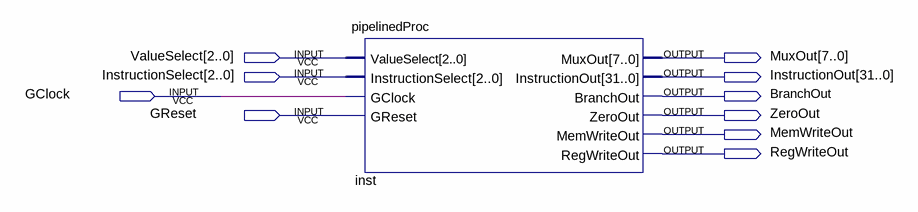
[diagram p0: schematic sheet]
// Quartus schematic TopLevelEntity.bdf as structural Verilog: 1 symbols, 10 pins
module TopLevelEntity (
  input  [2:0] ValueSelect,
  input  [2:0] InstructionSelect,
  input  GClock,
  input  GReset,
  output [7:0] MuxOut,
  output [31:0] InstructionOut,
  output BranchOut,
  output ZeroOut,
  output MemWriteOut,
  output RegWriteOut
);

  pipelinedProc inst (
    .ValueSelect(ValueSelect), .InstructionSelect(InstructionSelect), .GClock(GClock), .GReset(GReset),
    .MuxOut(MuxOut), .InstructionOut(InstructionOut), .BranchOut(BranchOut), .ZeroOut(ZeroOut),
    .MemWriteOut(MemWriteOut), .RegWriteOut(RegWriteOut));
endmodule
